# EAGLE schematic L000-Power (EAGLE 7.7.0)
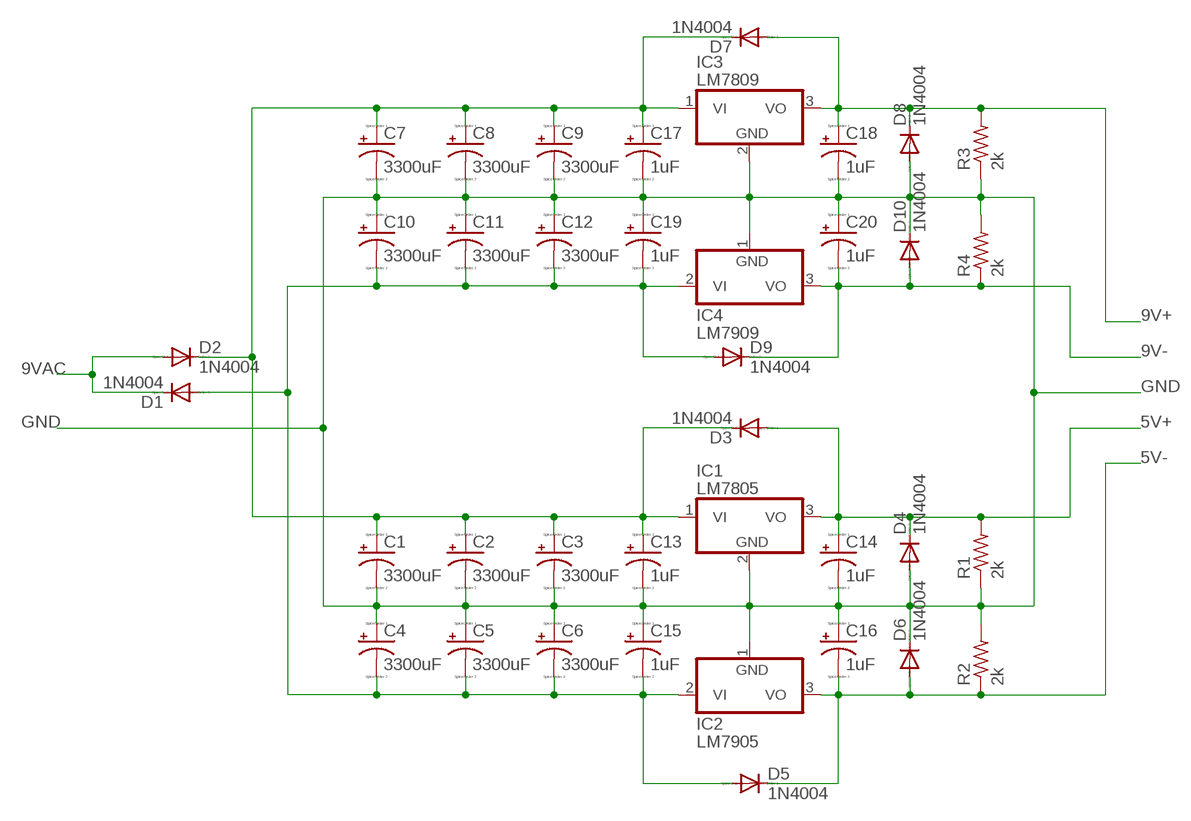
[diagram p0: schematic, sheet 1]

## Parts
C1  3300uF  CPOL-USE5-13  [E5-13]
C2  3300uF  CPOL-USE5-13  [E5-13]
C3  3300uF  CPOL-USE5-13  [E5-13]
C4  3300uF  CPOL-USE5-13  [E5-13]
C5  3300uF  CPOL-USE5-13  [E5-13]
C6  3300uF  CPOL-USE5-13  [E5-13]
C7  3300uF  CPOL-USE5-13  [E5-13]
C8  3300uF  CPOL-USE5-13  [E5-13]
C9  3300uF  CPOL-USE5-13  [E5-13]
C10  3300uF  CPOL-USE5-13  [E5-13]
C11  3300uF  CPOL-USE5-13  [E5-13]
C12  3300uF  CPOL-USE5-13  [E5-13]
C13  1uF  CPOL-USE5-13  [E5-13]
C14  1uF  CPOL-USE5-13  [E5-13]
C15  1uF  CPOL-USE5-13  [E5-13]
C16  1uF  CPOL-USE5-13  [E5-13]
C17  1uF  CPOL-USE5-13  [E5-13]
C18  1uF  CPOL-USE5-13  [E5-13]
C19  1uF  CPOL-USE5-13  [E5-13]
C20  1uF  CPOL-USE5-13  [E5-13]
D1  1N4004  [DO41-10]
D2  1N4004  [DO41-10]
D3  1N4004  [DO41-10]
D4  1N4004  [DO41-10]
D5  1N4004  [DO41-10]
D6  1N4004  [DO41-10]
D7  1N4004  [DO41-10]
D8  1N4004  [DO41-10]
D9  1N4004  [DO41-10]
D10  1N4004  [DO41-10]
IC1  LM7805  7805T  [TO220H]
IC2  LM7905  7905T  [TO220H]
IC3  LM7809  7808T  [TO220H]
IC4  LM7909  7908T  [TO220H]
R1  2k  R-US_0309/10  [0309/10]
R2  2k  R-US_0309/10  [0309/10]
R3  2k  R-US_0309/10  [0309/10]
R4  2k  R-US_0309/10  [0309/10]

## Nets
5V+: C14.+ D3.A D4.C IC1.3(VO) R1.2
5V-: C16.- D5.C D6.A IC2.3(VO) R2.1
9V+: C18.+ D7.A D8.C IC3.3(VO) R3.2
9V-: C20.- D9.C D10.A IC4.3(VO) R4.1
9VAC: D1.C D2.A
GND: C1.- C2.- C3.- C4.+ C5.+ C6.+ C7.- C8.- C9.- C10.+ C11.+ C12.+ C13.- C14.- C15.+ C16.+ C17.- C18.- C19.+ C20.+ D4.A D6.C D8.A D10.C IC1.2(GND) IC2.1(GND) IC3.2(GND) IC4.1(GND) R1.1 R2.2 R3.1 R4.2
N$1: C4.- C5.- C6.- C10.- C11.- C12.- C15.- C19.- D1.A D5.A D9.A IC2.2(VI) IC4.2(VI)
N$8: C1.+ C2.+ C3.+ C7.+ C8.+ C9.+ C13.+ C17.+ D2.C D3.C D7.C IC1.1(VI) IC3.1(VI)

## Library data of the parts
C1-C20 = resistor:CPOL-US: POLARIZED CAPACITOR, American symbol
D1-D10 = diode:1N4004: DIODE general purpose rectifier, 1 A
IC1 IC3 = linear:78*: Positive VOLTAGE REGULATOR Source: http://cache.national.com/ds/LM/LM78L05.pdf http://www.fairchildsemi.com/ds/LM/LM7805.pdf
IC2 IC4 = linear:79*: Negative VOLTAGE REGULATOR
R1-R4 = resistor:R-US_: RESISTOR, American symbol